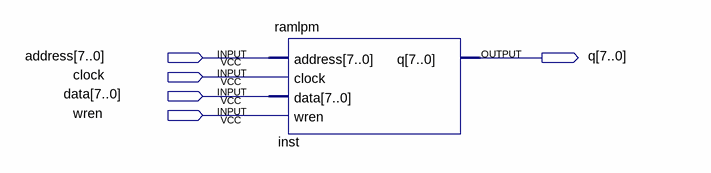
[diagram p0: schematic sheet]
// Quartus schematic ramlpm_activity1.bdf as structural Verilog: 1 symbols, 5 pins
module ramlpm_activity1 (
  input  [7:0] address,
  input  clock,
  input  [7:0] data,
  input  wren,
  output [7:0] q
);

  ramlpm inst (.address(address), .clock(clock), .data(data), .wren(wren), .q(q));
endmodule
